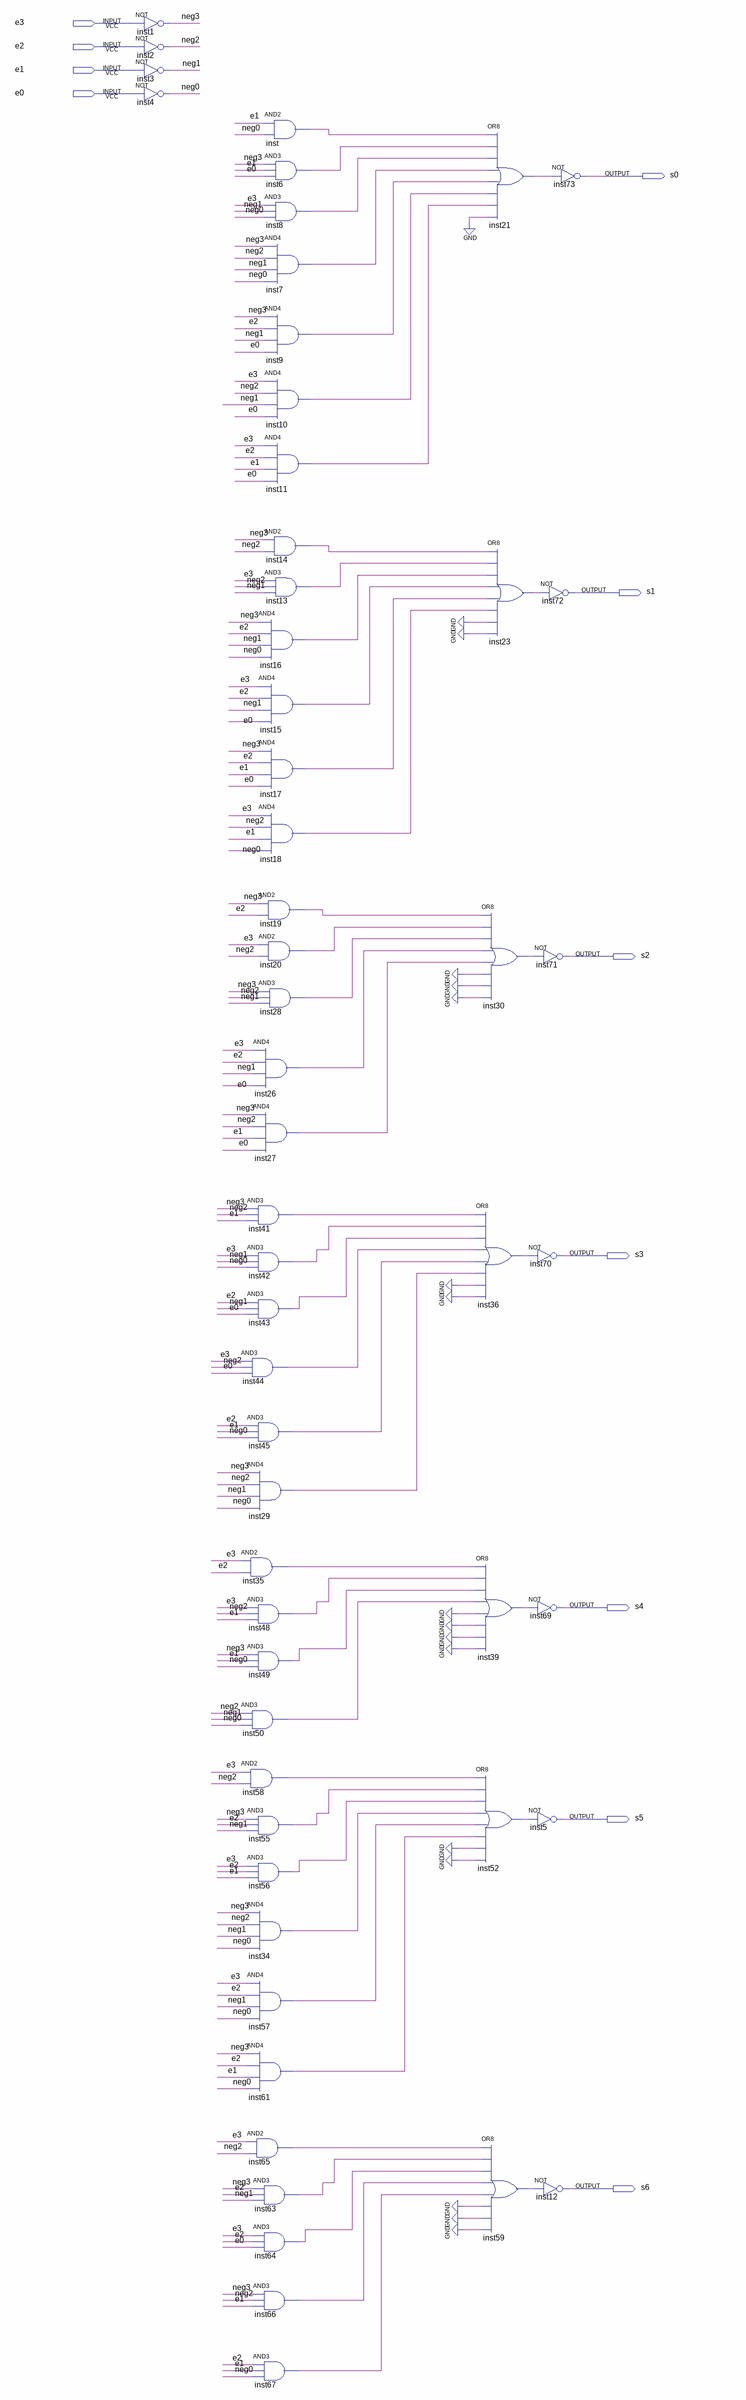
[diagram p0: schematic sheet]
// Quartus schematic display_7segmentos.bdf as structural Verilog: 57 symbols, 11 pins
module display_7segmentos (
  input  e3,
  input  e2,
  input  e1,
  input  e0,
  output s0,
  output s1,
  output s2,
  output s3,
  output s4,
  output s5,
  output s6
);

  wire inst6_out, inst7_out, inst8_out, inst9_out, inst10_out, inst11_out, inst13_out, inst14_out,
       inst15_out, inst16_out, inst17_out, inst18_out, inst19_out, inst20_out, inst21_out, inst23_out,
       inst26_out, inst27_out, inst28_out, inst29_out, inst30_out, inst34_out, inst35_out, inst36_out,
       inst39_out, inst41_out, inst42_out, inst43_out, inst44_out, inst45_out, inst48_out, inst49_out,
       inst50_out, inst52_out, inst55_out, inst56_out, inst57_out, inst58_out, inst59_out, inst61_out,
       inst63_out, inst64_out, inst65_out, inst66_out, inst67_out, inst_out, neg0, neg1, neg2, neg3;

  not inst1 (neg3, e3);
  not inst2 (neg2, e2);
  not inst3 (neg1, e1);
  not inst4 (neg0, e0);
  and inst44 (inst44_out, e3, neg2, e0);
  and inst35 (inst35_out, e3, e2);
  and inst50 (inst50_out, neg2, neg1, neg0);
  and inst58 (inst58_out, e3, neg2);
  and inst (inst_out, e1, neg0);
  and inst6 (inst6_out, neg3, e1, e0);
  and inst8 (inst8_out, e3, neg1, neg0);
  and inst7 (inst7_out, neg3, neg2, neg1, neg0);
  and inst9 (inst9_out, neg3, e2, neg1, e0);
  and inst10 (inst10_out, e3, neg2, neg1, e0);
  and inst11 (inst11_out, e3, e2, e1, e0);
  and inst14 (inst14_out, neg3, neg2);
  and inst13 (inst13_out, e3, neg2, neg1);
  and inst16 (inst16_out, neg3, e2, neg1, neg0);
  and inst15 (inst15_out, e3, e2, neg1, e0);
  and inst17 (inst17_out, neg3, e2, e1, e0);
  and inst18 (inst18_out, e3, neg2, e1, neg0);
  and inst19 (inst19_out, neg3, e2);
  and inst20 (inst20_out, e3, neg2);
  and inst28 (inst28_out, neg3, neg2, neg1);
  and inst26 (inst26_out, e3, e2, neg1, e0);
  and inst27 (inst27_out, neg3, neg2, e1, e0);
  and inst41 (inst41_out, neg3, neg2, e1);
  and inst42 (inst42_out, e3, neg1, neg0);
  and inst43 (inst43_out, e2, neg1, e0);
  and inst45 (inst45_out, e2, e1, neg0);
  and inst29 (inst29_out, neg3, neg2, neg1, neg0);
  and inst48 (inst48_out, e3, neg2, e1);
  and inst49 (inst49_out, neg3, e1, neg0);
  and inst55 (inst55_out, neg3, e2, neg1);
  and inst56 (inst56_out, e3, e2, e1);
  and inst34 (inst34_out, neg3, neg2, neg1, neg0);
  and inst57 (inst57_out, e3, e2, neg1, neg0);
  and inst61 (inst61_out, neg3, e2, e1, neg0);
  and inst65 (inst65_out, e3, neg2);
  and inst63 (inst63_out, neg3, e2, neg1);
  and inst64 (inst64_out, e3, e2, e0);
  and inst66 (inst66_out, neg3, neg2, e1);
  and inst67 (inst67_out, e2, e1, neg0);
  or inst36 (inst36_out, inst41_out, inst42_out, inst43_out, inst44_out, inst45_out, inst29_out, 1'b0, 1'b0);
  or inst39 (inst39_out, inst35_out, inst48_out, inst49_out, inst50_out, 1'b0, 1'b0, 1'b0, 1'b0);
  or inst52 (inst52_out, inst58_out, inst55_out, inst56_out, inst34_out, inst57_out, inst61_out, 1'b0, 1'b0);
  or inst21 (inst21_out, inst_out, inst6_out, inst8_out, inst7_out, inst9_out, inst10_out, inst11_out, 1'b0);
  or inst23 (inst23_out, inst14_out, inst13_out, inst16_out, inst15_out, inst17_out, inst18_out, 1'b0, 1'b0);
  or inst30 (inst30_out, inst19_out, inst20_out, inst28_out, inst26_out, inst27_out, 1'b0, 1'b0, 1'b0);
  or inst59 (inst59_out, inst65_out, inst63_out, inst64_out, inst66_out, inst67_out, 1'b0, 1'b0, 1'b0);
  not inst73 (s0, inst21_out);
  not inst72 (s1, inst23_out);
  not inst71 (s2, inst30_out);
  not inst70 (s3, inst36_out);
  not inst69 (s4, inst39_out);
  not inst5 (s5, inst52_out);
  not inst12 (s6, inst59_out);
endmodule
